# Altium project 555-timer clock.PrjPcb
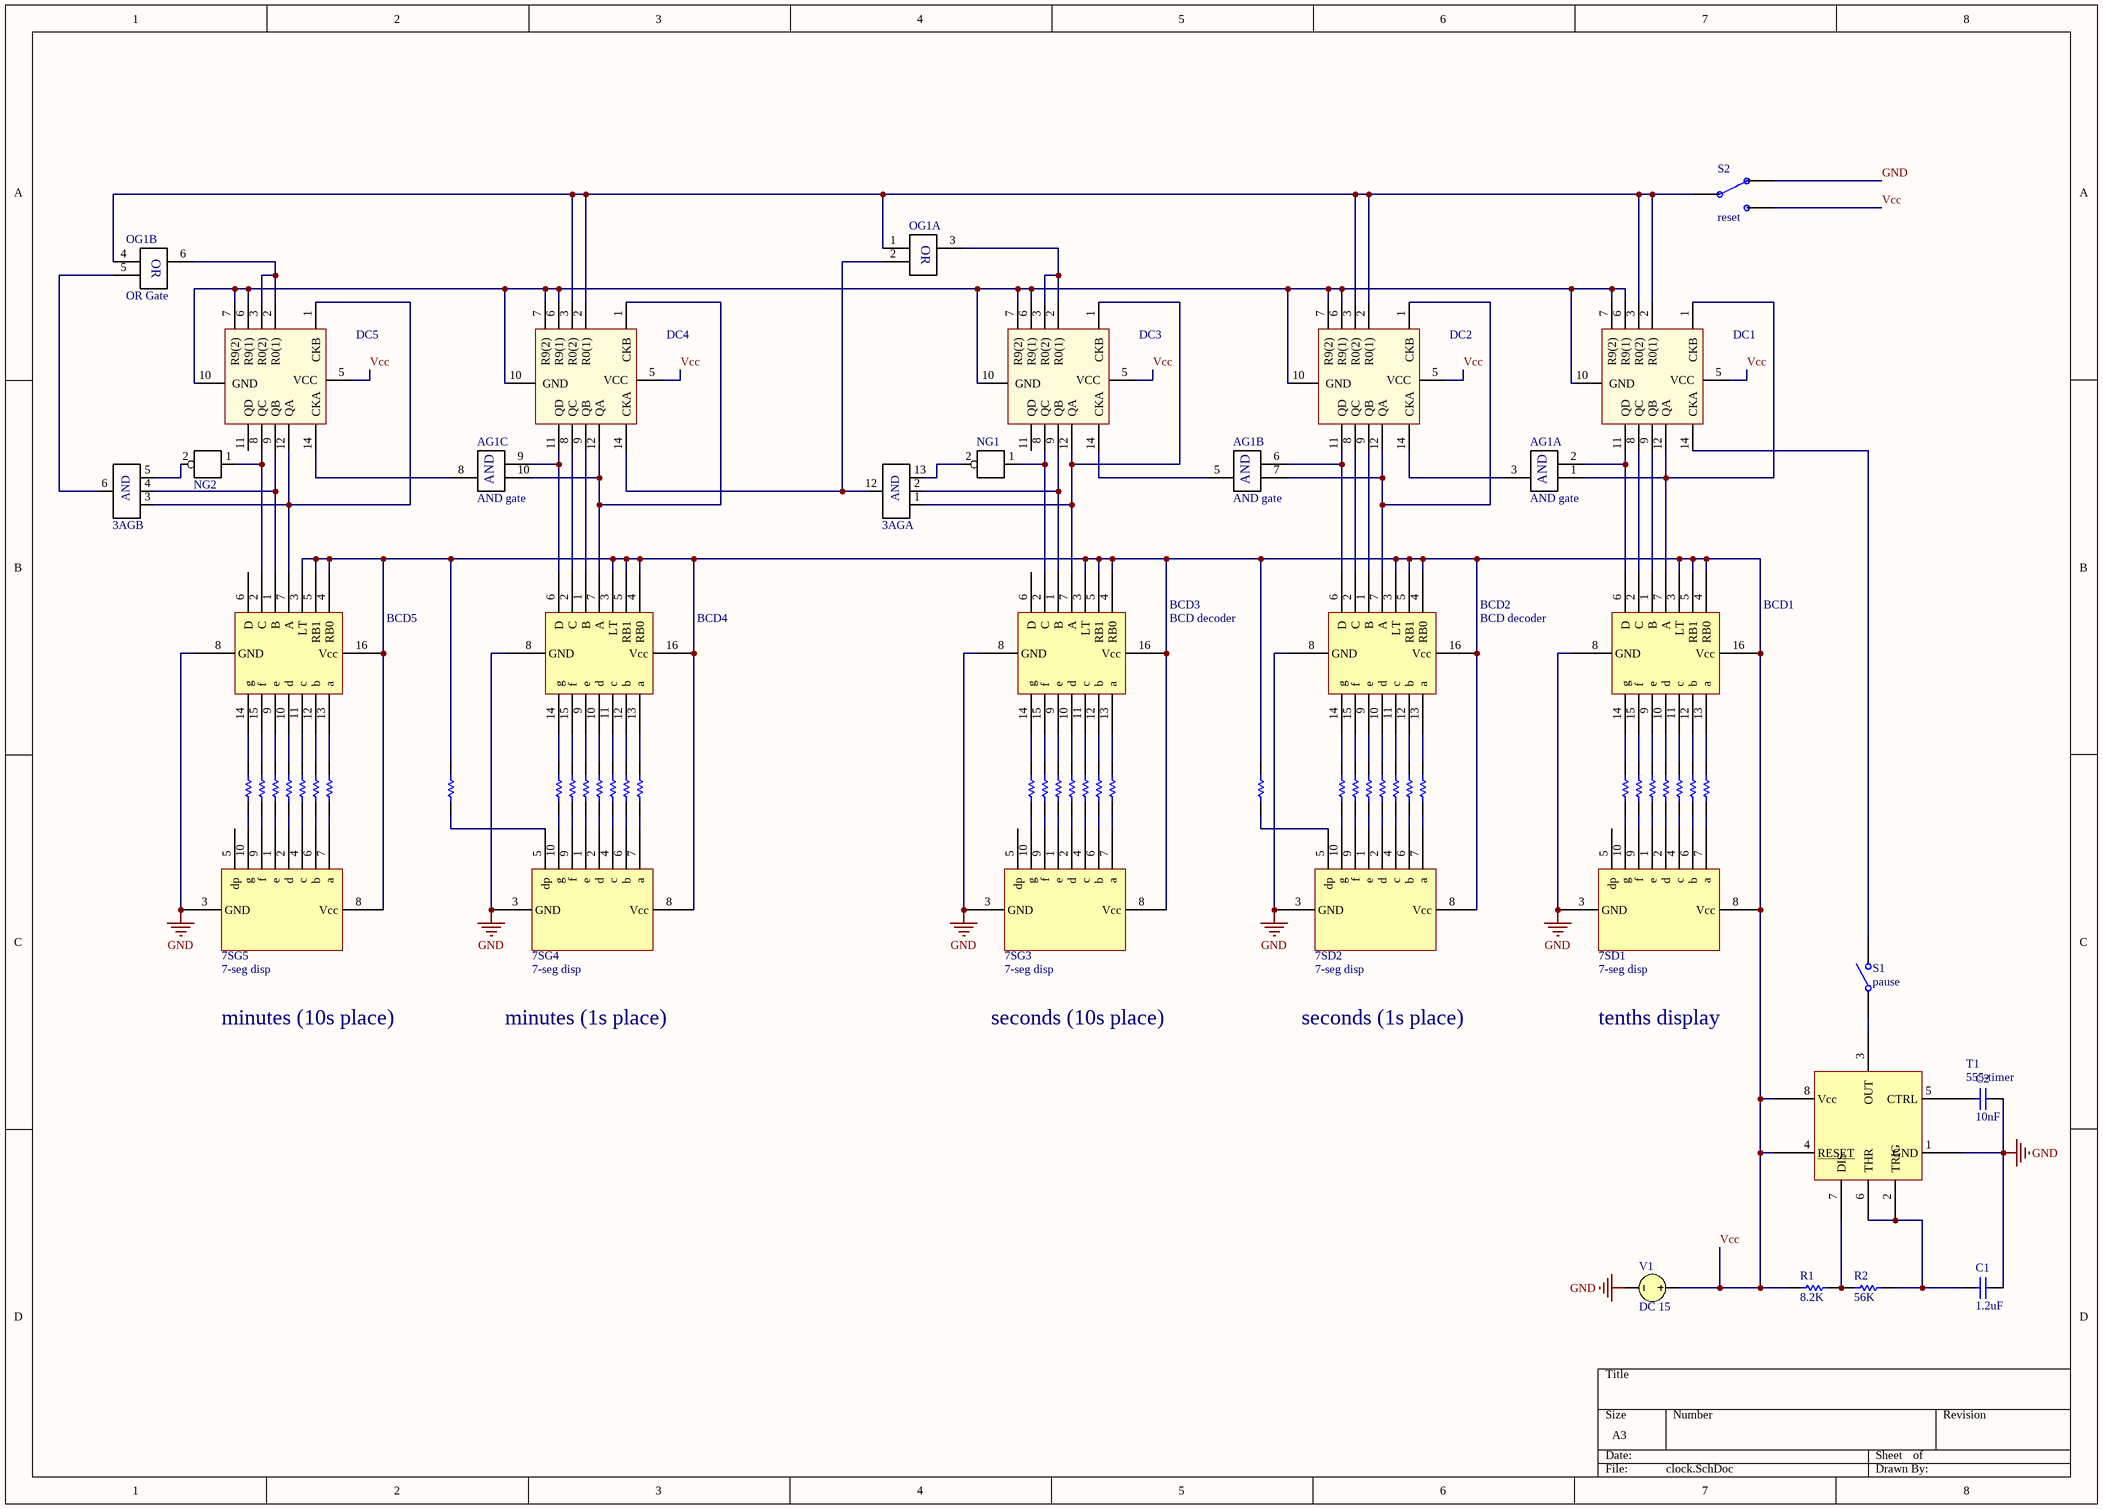
[diagram p0: clock.SchDoc]
1 sheet, 65 parts. Net scope: global (net labels, ports and power ports of the same name join across sheets).

## Sheet clock.SchDoc
size A3; SheetNumber: 1; SheetTotal: 1; SPICEModelCacheSJQINSVM: <root> / <DocumentId>SJQINSVM</DocumentId> / </root>

### Parts
3AG  DM7411N  (value not drawn)  (parts A,B of 3)
7SD1  7-seg disp
7SD2  7-seg disp
7SG3  7-seg disp
7SG4  7-seg disp
7SG5  7-seg disp
AG1  AND gate  (parts A,B,C of 4)
BCD1  BCD decoder  (value not drawn)
BCD2  BCD decoder
BCD3  BCD decoder
BCD4  BCD decoder  (value not drawn)
BCD5  BCD decoder  (value not drawn)
C1  value 1.2uF  [RAD-0.3]  (hidden comment: Cap)
C2  value 10nF  [RAD-0.3]  (hidden comment: Cap)
DC1  Decade counter (SN76LS90N)  [SN74LS90N]  (value not drawn)
DC2  Decade counter (SN76LS90N)  [SN74LS90N]  (value not drawn)
DC3  Decade counter (SN76LS90N)  [SN74LS90N]  (value not drawn)
DC4  Decade counter (SN76LS90N)  [SN74LS90N]  (value not drawn)
DC5  Decade counter (SN76LS90N)  [SN74LS90N]  (value not drawn)
NG1  NOT gate  (value not drawn)
NG2  NOT gate  (value not drawn)
OG1  OR Gate  (value not drawn)  (parts A,B of 2)
R1  value 8.2K  [AXIAL-0.3]  (hidden comment: Res1)
R2  value 56K  [AXIAL-0.3]  (hidden comment: Res1)
R3  Res1  [AXIAL-0.3]  (value not drawn)
R4  Res1  [AXIAL-0.3]  (value not drawn)
R5  Res1  [AXIAL-0.3]  (value not drawn)
R6  Res1  [AXIAL-0.3]  (value not drawn)
R7  Res1  [AXIAL-0.3]  (value not drawn)
R8  Res1  [AXIAL-0.3]  (value not drawn)
R9  Res1  [AXIAL-0.3]  (value not drawn)
R10  Res1  [AXIAL-0.3]  (value not drawn)
R11  Res1  [AXIAL-0.3]  (value not drawn)
R12  Res1  [AXIAL-0.3]  (value not drawn)
R13  Res1  [AXIAL-0.3]  (value not drawn)
R14  Res1  [AXIAL-0.3]  (value not drawn)
R15  Res1  [AXIAL-0.3]  (value not drawn)
R16  Res1  [AXIAL-0.3]  (value not drawn)
R17  Res1  [AXIAL-0.3]  (value not drawn)
R18  Res1  [AXIAL-0.3]  (value not drawn)
R19  Res1  [AXIAL-0.3]  (value not drawn)
R20  Res1  [AXIAL-0.3]  (value not drawn)
R21  Res1  [AXIAL-0.3]  (value not drawn)
R22  Res1  [AXIAL-0.3]  (value not drawn)
R23  Res1  [AXIAL-0.3]  (value not drawn)
R24  Res1  [AXIAL-0.3]  (value not drawn)
R25  Res1  [AXIAL-0.3]  (value not drawn)
R26  Res1  [AXIAL-0.3]  (value not drawn)
R27  Res1  [AXIAL-0.3]  (value not drawn)
R28  Res1  [AXIAL-0.3]  (value not drawn)
R29  Res1  [AXIAL-0.3]  (value not drawn)
R30  Res1  [AXIAL-0.3]  (value not drawn)
R31  Res1  [AXIAL-0.3]  (value not drawn)
R32  Res1  [AXIAL-0.3]  (value not drawn)
R33  Res1  [AXIAL-0.3]  (value not drawn)
R34  Res1  [AXIAL-0.3]  (value not drawn)
R35  Res1  [AXIAL-0.3]  (value not drawn)
R36  Res1  [AXIAL-0.3]  (value not drawn)
R37  Res1  [AXIAL-0.3]  (value not drawn)
R38  Res1  [AXIAL-0.3]  (value not drawn)
R39  Res1  [AXIAL-0.3]  (value not drawn)
S1  pause  [SPST-2]
S2  reset  [Switch]
T1  555-timer
V1  DC 15

### Nets
GND: 7SD1.3(GND) 7SD2.3(GND) 7SG3.3(GND) 7SG4.3(GND) 7SG5.3(GND) BCD1.8(GND) BCD2.8(GND) BCD3.8(GND) BCD4.8(GND) BCD5.8(GND) C1.1 C2.1 S2.3 T1.1(GND) V1.2
Vcc: 7SD1.8(Vcc) 7SD2.8(Vcc) 7SG3.8(Vcc) 7SG4.8(Vcc) 7SG5.8(Vcc) BCD1.3(LT) BCD1.4(RB0) BCD1.5(RB1) BCD1.16(Vcc) BCD2.3(LT) BCD2.4(RB0) BCD2.5(RB1) BCD2.16(Vcc) BCD3.3(LT) BCD3.4(RB0) BCD3.5(RB1) BCD3.16(Vcc) BCD4.3(LT) BCD4.4(RB0) BCD4.5(RB1) BCD4.16(Vcc) BCD5.3(LT) BCD5.4(RB0) BCD5.5(RB1) BCD5.16(Vcc) DC1.5(VCC) DC2.5(VCC) DC3.5(VCC) DC4.5(VCC) DC5.5(VCC) R1.2 R17.1 R32.1 S2.1 T1.4(RESET) T1.8(Vcc) V1.1
Net3AG_1: 3AG.1 BCD3.7(A) DC3.1(CKB) DC3.12(QA)
Net3AG_2: 3AG.2 BCD3.1(B) DC3.9(QB)
Net3AG_3: 3AG.3 BCD5.7(A) DC5.1(CKB) DC5.12(QA)
Net3AG_4: 3AG.4 BCD5.1(B) DC5.9(QB)
Net3AG_5: 3AG.5 NG2.2
Net3AG_6: 3AG.6 OG1.5
Net3AG_12: 3AG.12 DC4.14(CKA) OG1.2
Net3AG_13: 3AG.13 NG1.2
Net7SD1_1: 7SD1.1(e) R7.2
Net7SD1_2: 7SD1.2(d) R6.2
Net7SD1_4: 7SD1.4(c) R5.2
Net7SD1_6: 7SD1.6(b) R4.2
Net7SD1_7: 7SD1.7(a) R3.2
Net7SD1_9: 7SD1.9(f) R8.2
Net7SD1_10: 7SD1.10(g) R9.2
Net7SD2_1: 7SD2.1(e) R14.2
Net7SD2_2: 7SD2.2(d) R13.2
Net7SD2_4: 7SD2.4(c) R12.2
Net7SD2_5: 7SD2.5(dp) R17.2
Net7SD2_6: 7SD2.6(b) R11.2
Net7SD2_7: 7SD2.7(a) R10.2
Net7SD2_9: 7SD2.9(f) R15.2
Net7SD2_10: 7SD2.10(g) R16.2
Net7SG3_1: 7SG3.1(e) R22.2
Net7SG3_2: 7SG3.2(d) R21.2
Net7SG3_4: 7SG3.4(c) R20.2
Net7SG3_6: 7SG3.6(b) R19.2
Net7SG3_7: 7SG3.7(a) R18.2
Net7SG3_9: 7SG3.9(f) R23.2
Net7SG3_10: 7SG3.10(g) R24.2
Net7SG4_1: 7SG4.1(e) R29.2
Net7SG4_2: 7SG4.2(d) R28.2
Net7SG4_4: 7SG4.4(c) R27.2
Net7SG4_5: 7SG4.5(dp) R32.2
Net7SG4_6: 7SG4.6(b) R26.2
Net7SG4_7: 7SG4.7(a) R25.2
Net7SG4_9: 7SG4.9(f) R30.2
Net7SG4_10: 7SG4.10(g) R31.2
Net7SG5_1: 7SG5.1(e) R37.2
Net7SG5_2: 7SG5.2(d) R36.2
Net7SG5_4: 7SG5.4(c) R35.2
Net7SG5_6: 7SG5.6(b) R34.2
Net7SG5_7: 7SG5.7(a) R33.2
Net7SG5_9: 7SG5.9(f) R38.2
Net7SG5_10: 7SG5.10(g) R39.2
NetAG1_1: AG1.1 BCD1.7(A) DC1.1(CKB) DC1.12(QA)
NetAG1_2: AG1.2 BCD1.6(D) DC1.11(QD)
NetAG1_3: AG1.3 DC2.14(CKA)
NetAG1_5: AG1.5 DC3.14(CKA)
NetAG1_6: AG1.6 BCD2.6(D) DC2.11(QD)
NetAG1_7: AG1.7 BCD2.7(A) DC2.1(CKB) DC2.12(QA)
NetAG1_8: AG1.8 DC5.14(CKA)
NetAG1_9: AG1.9 BCD4.6(D) DC4.11(QD)
NetAG1_10: AG1.10 BCD4.7(A) DC4.1(CKB) DC4.12(QA)
NetBCD1_1: BCD1.1(B) DC1.9(QB)
NetBCD1_2: BCD1.2(C) DC1.8(QC)
NetBCD1_9: BCD1.9(e) R7.1
NetBCD1_10: BCD1.10(d) R6.1
NetBCD1_11: BCD1.11(c) R5.1
NetBCD1_12: BCD1.12(b) R4.1
NetBCD1_13: BCD1.13(a) R3.1
NetBCD1_14: BCD1.14(g) R9.1
NetBCD1_15: BCD1.15(f) R8.1
NetBCD2_1: BCD2.1(B) DC2.9(QB)
NetBCD2_2: BCD2.2(C) DC2.8(QC)
NetBCD2_9: BCD2.9(e) R14.1
NetBCD2_10: BCD2.10(d) R13.1
NetBCD2_11: BCD2.11(c) R12.1
NetBCD2_12: BCD2.12(b) R11.1
NetBCD2_13: BCD2.13(a) R10.1
NetBCD2_14: BCD2.14(g) R16.1
NetBCD2_15: BCD2.15(f) R15.1
NetBCD3_2: BCD3.2(C) DC3.8(QC) NG1.1
NetBCD3_9: BCD3.9(e) R22.1
NetBCD3_10: BCD3.10(d) R21.1
NetBCD3_11: BCD3.11(c) R20.1
NetBCD3_12: BCD3.12(b) R19.1
NetBCD3_13: BCD3.13(a) R18.1
NetBCD3_14: BCD3.14(g) R24.1
NetBCD3_15: BCD3.15(f) R23.1
NetBCD4_1: BCD4.1(B) DC4.9(QB)
NetBCD4_2: BCD4.2(C) DC4.8(QC)
NetBCD4_9: BCD4.9(e) R29.1
NetBCD4_10: BCD4.10(d) R28.1
NetBCD4_11: BCD4.11(c) R27.1
NetBCD4_12: BCD4.12(b) R26.1
NetBCD4_13: BCD4.13(a) R25.1
NetBCD4_14: BCD4.14(g) R31.1
NetBCD4_15: BCD4.15(f) R30.1
NetBCD5_2: BCD5.2(C) DC5.8(QC) NG2.1
NetBCD5_9: BCD5.9(e) R37.1
NetBCD5_10: BCD5.10(d) R36.1
NetBCD5_11: BCD5.11(c) R35.1
NetBCD5_12: BCD5.12(b) R34.1
NetBCD5_13: BCD5.13(a) R33.1
NetBCD5_14: BCD5.14(g) R39.1
NetBCD5_15: BCD5.15(f) R38.1
NetC1_2: C1.2 R2.1 T1.2(TRIG) T1.6(THR)
NetC2_2: C2.2 T1.5(CTRL)
NetDC1_2: DC1.2(R0(1)) DC1.3(R0(2)) DC2.2(R0(1)) DC2.3(R0(2)) DC4.2(R0(1)) DC4.3(R0(2)) OG1.1 OG1.4 S2.2
NetDC1_6: DC1.6(R9(1)) DC1.7(R9(2)) DC1.10(GND) DC2.6(R9(1)) DC2.7(R9(2)) DC2.10(GND) DC3.6(R9(1)) DC3.7(R9(2)) DC3.10(GND) DC4.6(R9(1)) DC4.7(R9(2)) DC4.10(GND) DC5.6(R9(1)) DC5.7(R9(2)) DC5.10(GND)
NetDC1_14: DC1.14(CKA) S1.2(NO)
NetDC3_2: DC3.2(R0(1)) DC3.3(R0(2)) OG1.3
NetDC5_2: DC5.2(R0(1)) DC5.3(R0(2)) OG1.6
NetR1_1: R1.1 R2.2 T1.7(DIS)
NetS1_1: S1.1(COMMON) T1.3(OUT)

Not connected (* = marked no-connect by the designer): 7SD1 5(dp); 7SG3 5(dp); 7SG5 5(dp); BCD3 6(D); BCD5 6(D); DC3 11(QD); DC5 11(QD)

### Notes on the sheet
- minutes (10s place)
- minutes (1s place)
- seconds (10s place)
- seconds (1s place)
- tenths display
- (in symbol 3AND gate, part A) AND
- (in symbol 3AND gate, part B) AND
- (in symbol AND gate, part A) AND
- (in symbol AND gate, part B) AND
- (in symbol AND gate, part C) AND
- (in symbol OR Gate, part A) OR
- (in symbol OR Gate, part B) OR

### Library data of the parts
3AG = 3AND gate
C1 C2 = Cap: Capacitor; Published: 8-Jun-2000; LatestRevisionDate: 17-Jul-2002; LatestRevisionNote: Re-released for DXP Platform.; PackageReference: RAD-0.3; Publisher: Altium Limited; PackageDescription: Radial Cap, Thru-Hole; 2 Leads; 0.3 in Pin Spacing
R1 R2 = Res1: Resistor; Published: 8-Jun-2000; LatestRevisionDate: 17-Jul-2002; LatestRevisionNote: Re-released for DXP Platform.; PackageReference: AXIAL-0.3; Publisher: Altium Limited; PackageDescription: Axial Device, Thru-Hole; 2 Leads; 0.3 in Pin Spacing
R3-R39 = Res1: Resistor; Value: 330; Published: 8-Jun-2000; LatestRevisionDate: 17-Jul-2002; LatestRevisionNote: Re-released for DXP Platform.; PackageReference: AXIAL-0.3; Publisher: Altium Limited; PackageDescription: Axial Device, Thru-Hole; 2 Leads; 0.3 in Pin Spacing
S1 = SW-SPST: Single-Pole, Single-Throw Switch; Published: 24-Mar-1999; LatestRevisionDate: 17-Jul-2002; LatestRevisionNote: Re-released for DXP Platform.; PackageReference: SPST-2; Publisher: Altium Limited; PackageDescription: Switch; 2 Leads
S2 = Switch
V1 = VSRC: Voltage Source; Note: PCB Footprint - Not required; AC Magnitude: 1; AC Phase: 0; Value: 15; Published: 8-Jun-2000; LatestRevisionDate: 17-Jul-2002; LatestRevisionNote: Re-released for DXP Platform.; PackageReference: Not Applicable; Publisher: Altium Limited